# EAGLE design ece_411_team9_bird_feeder (EAGLE 9.6.2)
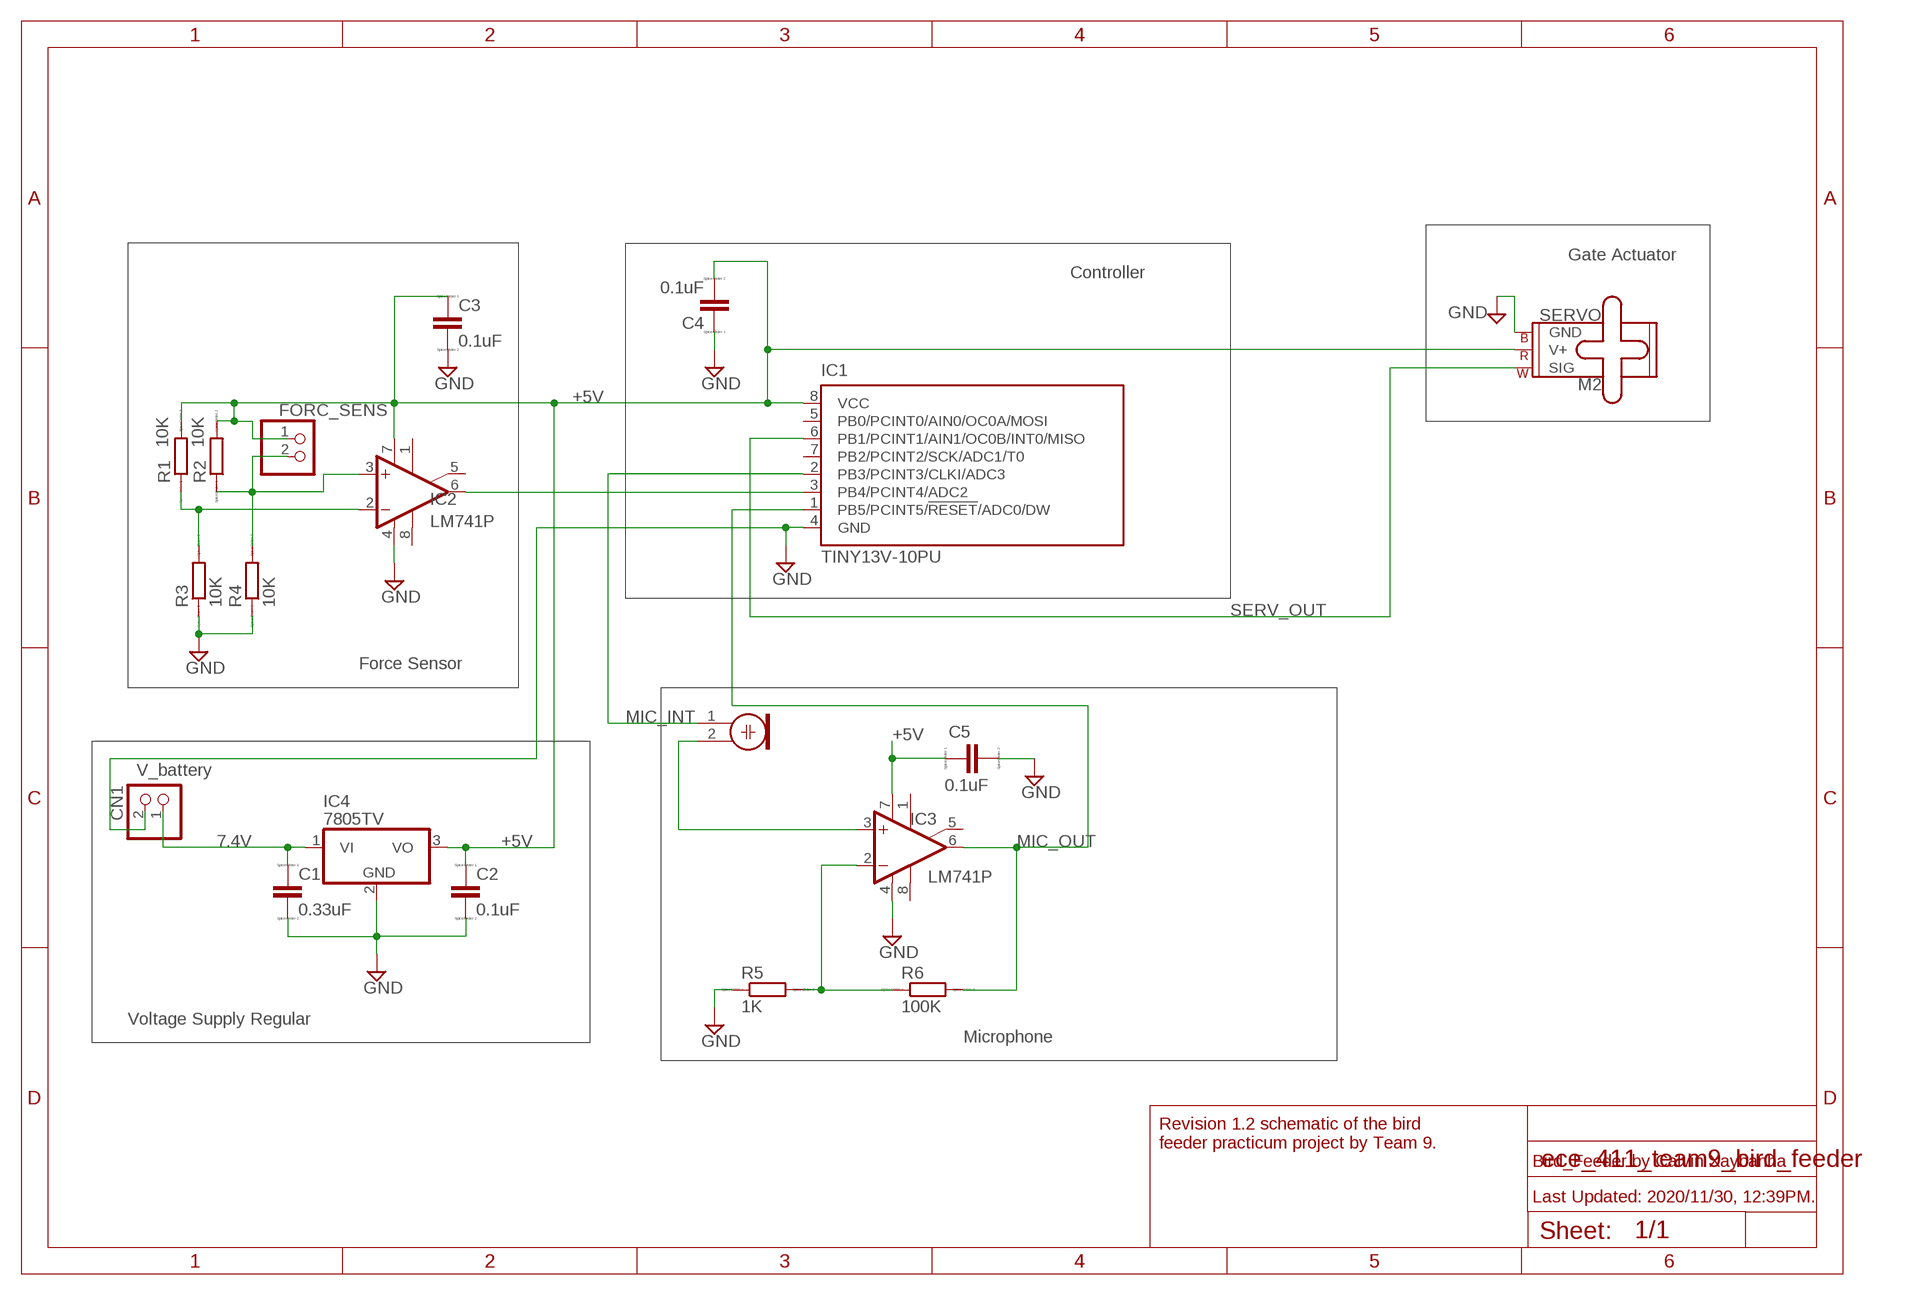
[diagram p0: schematic, sheet 1]

## Parts
C1  0.33uF  C  [C0805]
C2  0.1uF  C  [C0805]
C3  0.1uF  C  [C0805]
C4  0.1uF  C  [C0805]
C5  0.1uF  C  [C0805]
CN1  V_battery  JST_2PIN-SMT  [JST-PH-2-SMT]
FORC_SENS  PINHD-1X2/90  [1X02/90]
IC1  TINY13V-10PU  [DIL08]
IC2  LM741P  [DIL08]
IC3  LM741P  [DIL08]
IC4  7805TV  [TO220V]
M1  ELECTRET_MICROPHON-WM.64PN  [WM-64PN]
M2  SERVO  [1X03]
R1  10K  R  [R0805]
R2  10K  R  [R0805]
R3  10K  R  [R0805]
R4  10K  R  [R0805]
R5  1K  R  [R0805]
R6  100K  R  [R0805]

## Nets
7.4V: C1.1 CN1.1 IC4.1(VI)
+5V [Power]: C2.1 C3.1 C4.2 C5.1 FORC_SENS.1 IC1.8(VCC) IC2.7(V+) IC3.7(V+) IC4.3(VO) M2.2(V+) R1.2 R2.2
FSNS_OP2 [Signals]: IC2.2(-IN) R1.1 R3.2
FSNS_OP3 [Signals]: FORC_SENS.2 IC2.3(+IN) R2.1 R4.2
FSNS_OUT [Signals]: IC1.3(PB4/PCINT4/ADC2) IC2.6(OUT)
GND: C1.2 C2.2 C3.2 C4.1 C5.2 CN1.2 IC1.4(GND) IC2.4(V-) IC3.4(V-) IC4.2(GND) M2.3(GND) R3.1 R4.1 R5.1
MIC_INT [Signals]: IC1.2(PB3/PCINT3/CLKI/ADC3) M1.1
MIC_OP2 [Signals]: IC3.2(-IN) R5.2 R6.1
MIC_OP3 [Signals]: IC3.3(+IN) M1.2
MIC_OUT [Signals]: IC1.1(PB5/PCINT5/!RESET!/ADC0/DW) IC3.6(OUT) R6.2
SERV_OUT [Signals]: IC1.6(PB1/PCINT1/AIN1/OC0B/INT0/MISO) M2.1(SIG)
Unconnected: IC1.5(PB0/PCINT0/AIN0/OC0A/MOSI) IC1.7(PB2/PCINT2/SCK/ADC1/T0) IC2.1(ON1) IC2.5(ON2) IC2.8(OPT) IC3.1(ON1) IC3.5(ON2) IC3.8(OPT)

## Notes on the sheet
- Gate Actuator
- Controller
- Force Sensor
- Voltage Supply Regular
- Microphone
- Revision 1.2 schematic of the bird
  feeder practicum project by Team 9.
- Bird_Feeder by Calvin Xaybanha
- Last Updated: 2020/11/30, 12:39PM.

## Library data of the parts
C1-C5 = eagle-ltspice:C: CAPACITOR, European symbol; SPICEMODEL: NONE; SPICEPREFIX: C
CN1 = adafruit:JST_2PIN: JST 2-Pin Connectors of various flavors SMT-RA (S2B-PH-SM4) 4UConnector #17311 SMT (B2B-PH-SM4) THM-RA (S2B-PH) THM (B2B-PH)
FORC_SENS = pinhead:PINHD-1X2: PIN HEADER
IC1 = atmel:TINY13: 8-bit AVR Microcontroller with 1K Bytes In-System Programmable Flash Source: http://www.atmel.com/dyn/resources/prod_documents/2535S.pdf; MPN: ATTINY13V-10PU; OC_FARNELL: 9171576; OC_NEWARK: 96K6523
IC2 IC3 = linear:*741: OP AMP
IC4 = linear:78*: Positive VOLTAGE REGULATOR Source: http://cache.national.com/ds/LM/LM78L05.pdf http://www.fairchildsemi.com/ds/LM/LM7805.pdf
M1 = microphon:ELECTRET_MICROPHON-: Electret Condenser Microphone
M2 = SparkFun-Electromechanical:SERVO: Servo Motor 3-pin connector for a standard servo motor (voltage supply, ground, and control signal.) SparkFun Products Servo - Generic (Sub-Micro Size) <https://www.sparkfun.com/products/9065> (ROB-09065) Servo - Generic High Torque Continuous Rotation (Standard Size) <https://www.sparkfun.com/products/9347> (ROB-09347) Servo - Generic High Torque (Standard Size) <https://www.sparkfun.com/products/11965> (ROB-11965)
R1-R6 = eagle-ltspice:R: RESISTOR, European symbol; SPICEMODEL: NONE; SPICEPREFIX: R

## Module CONTROLLER
Ports: 

### Library data of the parts

## Net classes
0 default: width 0.305 mm
1 Power: width 1.27 mm
2 Signals: width 0.305 mm

## Board
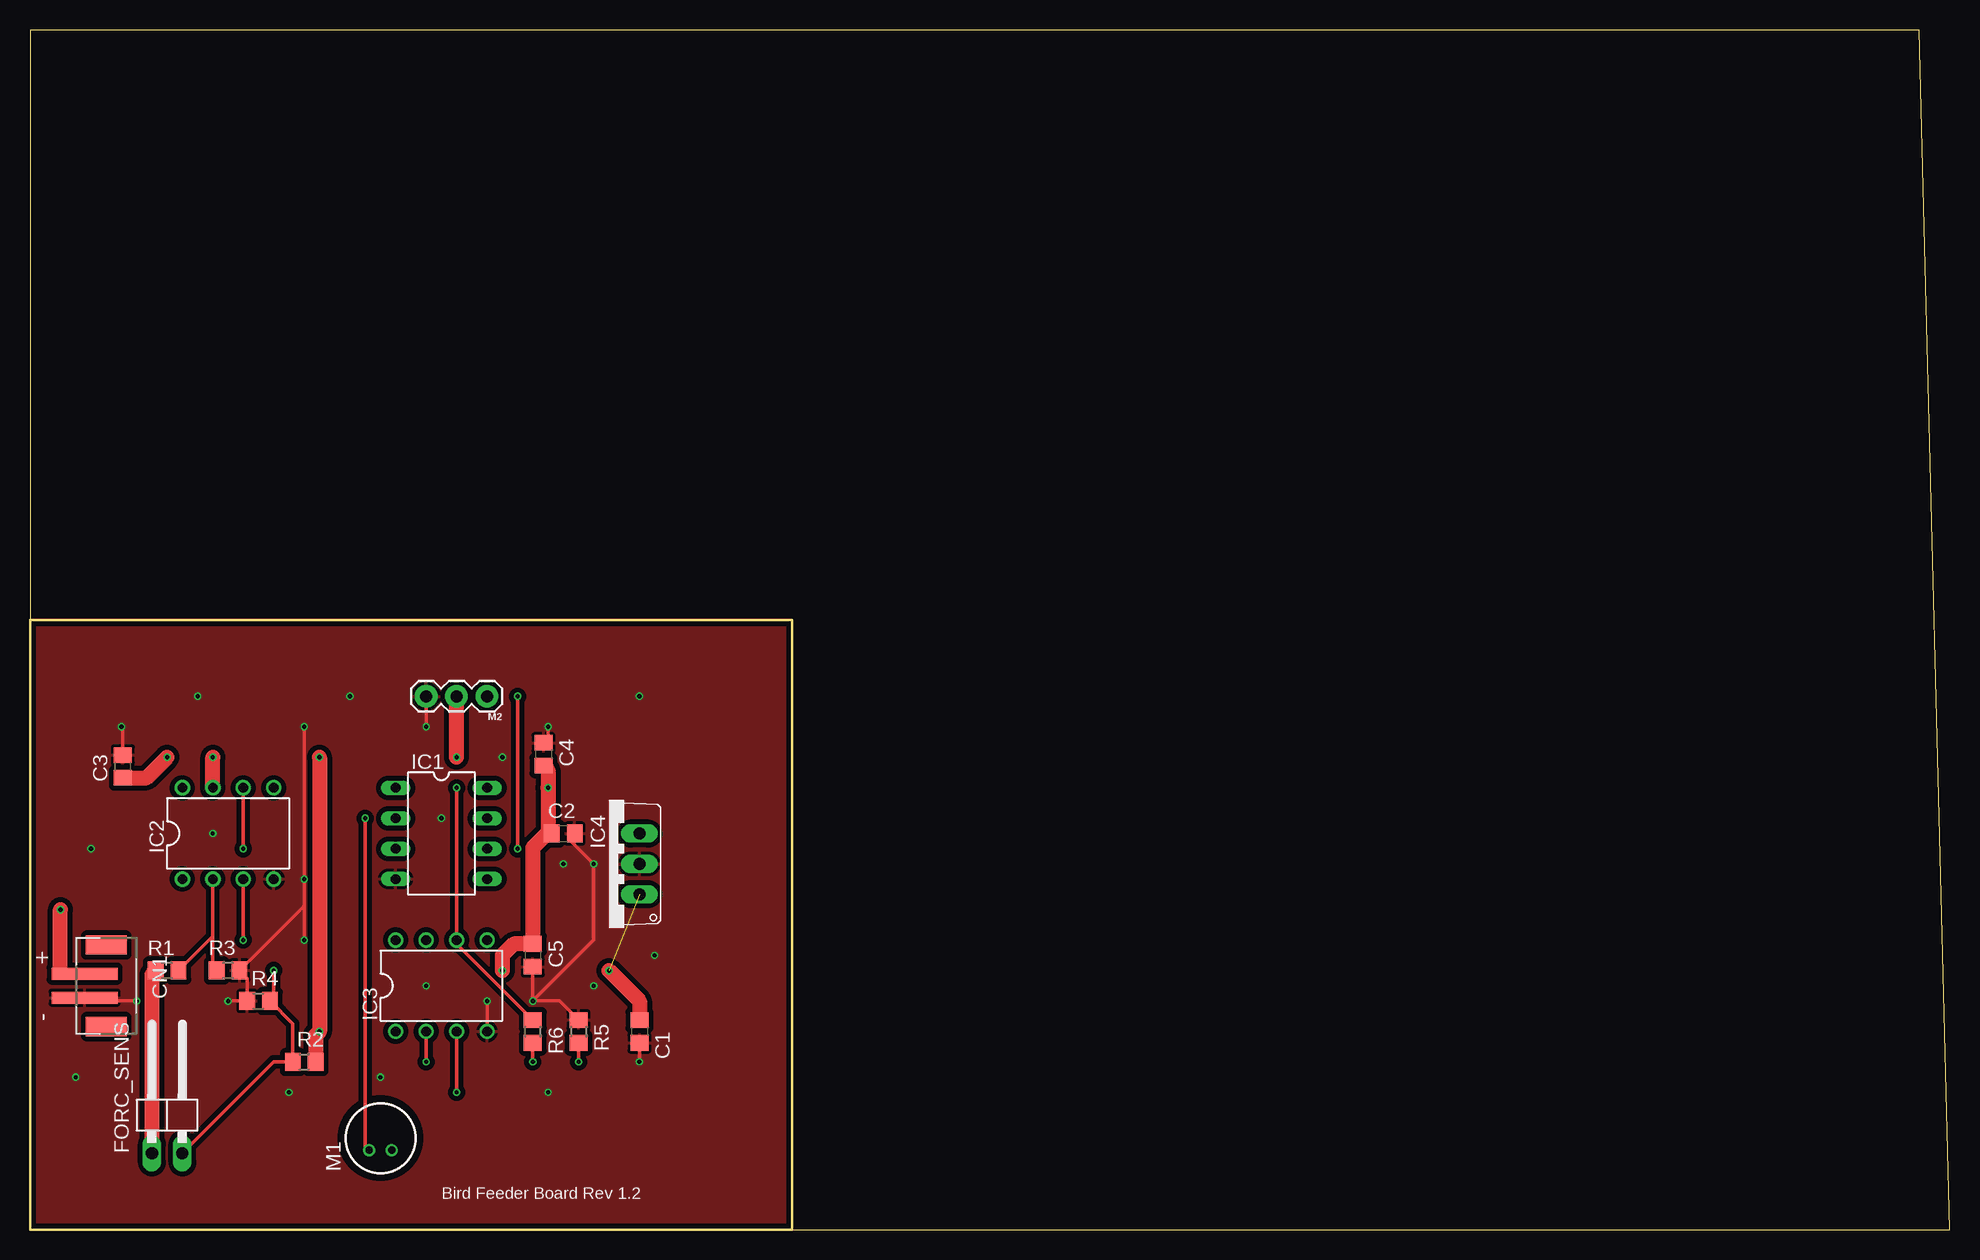
[diagram p1: board, top side]
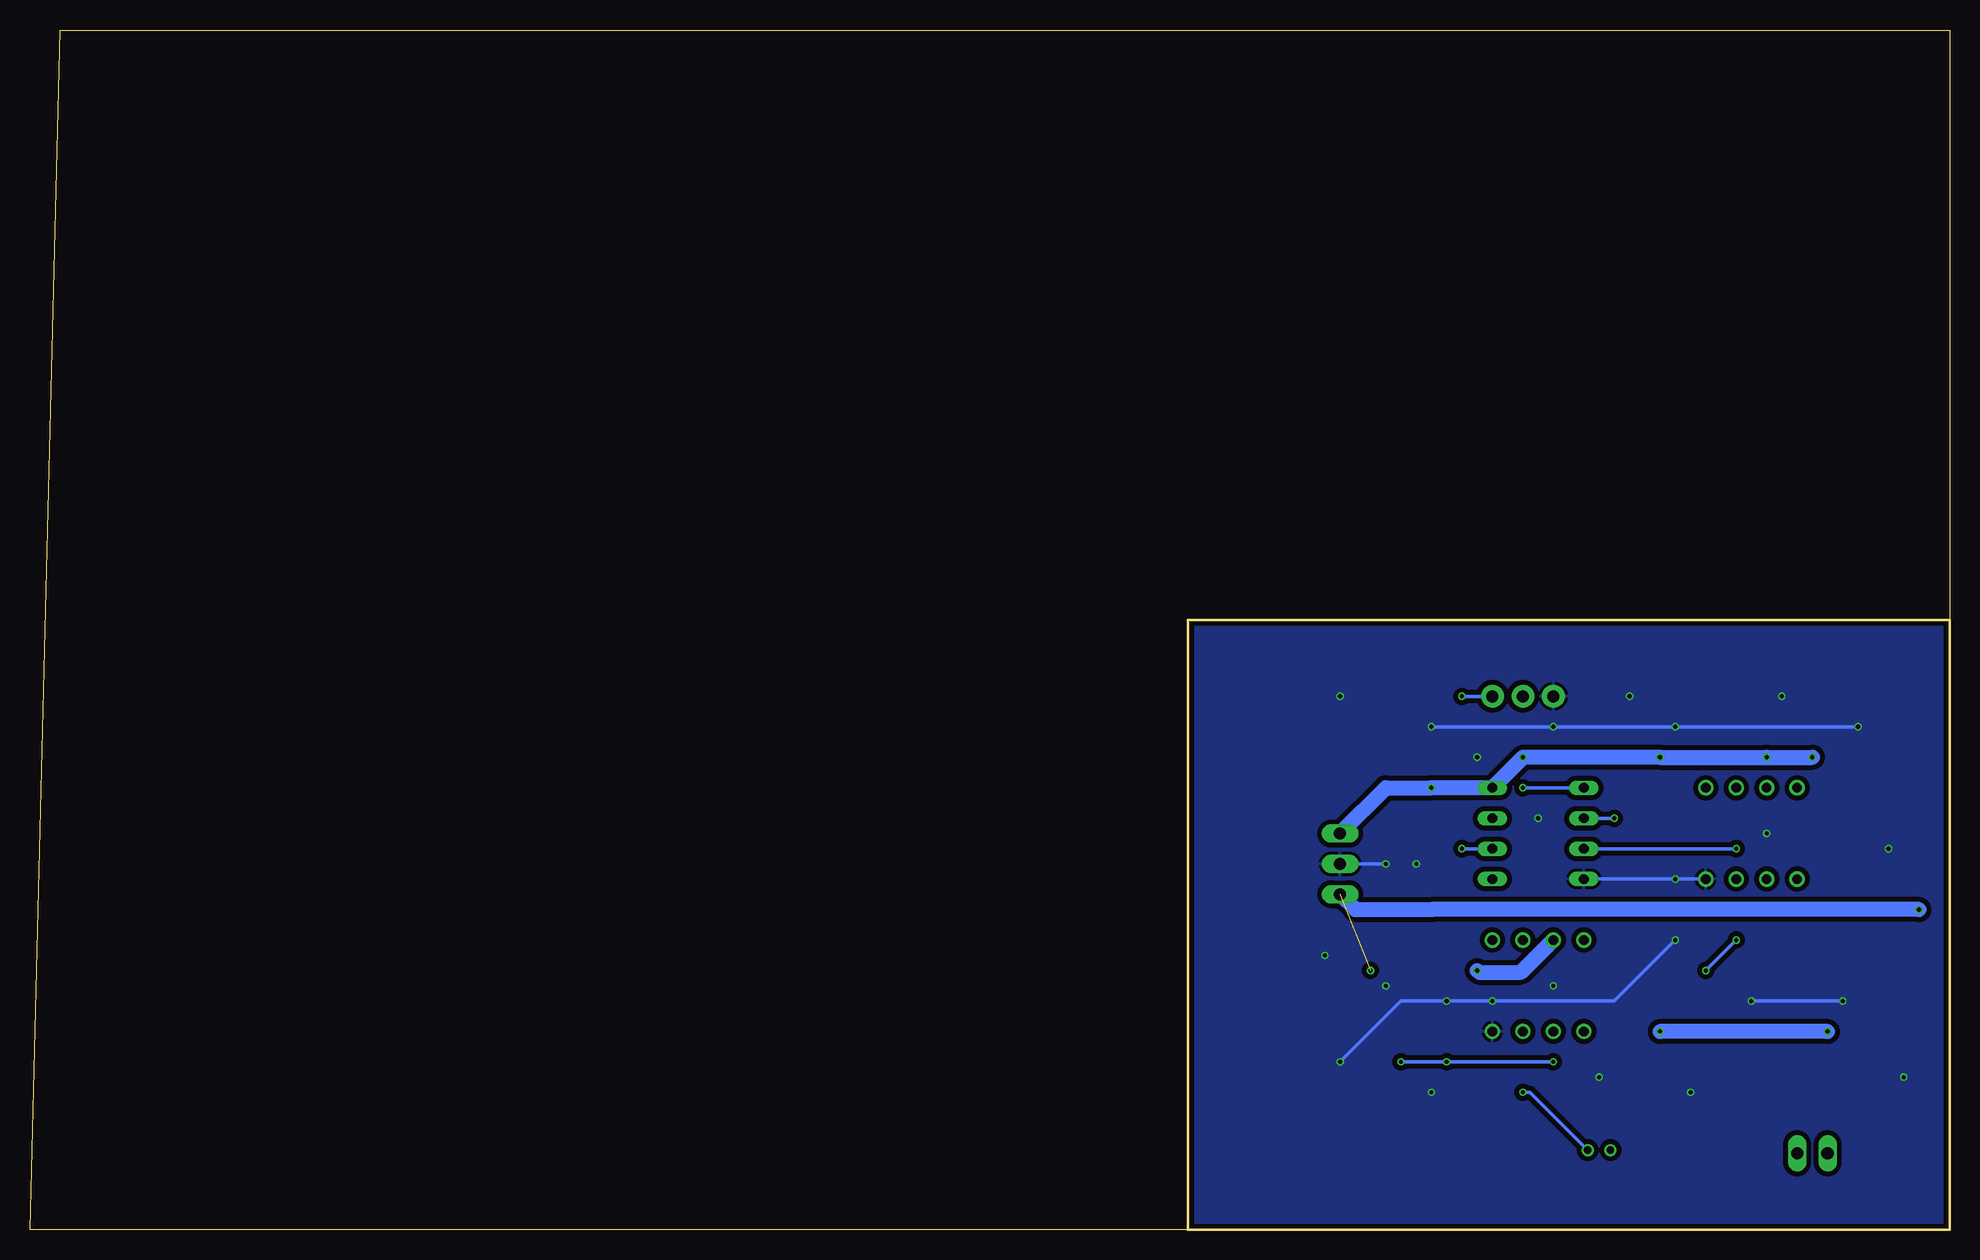
[diagram p2: board, bottom side, seen from below]

Size 160 x 100 mm. Coordinates in mm from the lower left corner, seen from the top.
Outline: 63.5,0 160,0 157.46,100 0,100 0,50.8
Outline: 0,50.8 0,0 63.5,0
Outline: 0,50.8 63.5,50.8 63.5,0
Copper layers (1*16): Top 0.035559375mm / dielectric 1.6mm / Bottom 0.035559375mm
Design rules "oshpark-2layer": minimum track width 6mil, minimum drill 10mil, track to track 6mil, track to pad 6mil, pad to pad 6mil, via to via 6mil, smd to smd 6mil, copper to edge 15mil, drill to drill 6mil, minimum pad ring 5mil, minimum via ring 5mil, stop-mask expansion 2.5mil, vias tented up to drill 0mil, thermal gap 10mil

### Footprints (pad centres in the part's own frame; a part is rotated, then mirrored left to right if it is on the bottom)
C0805 = smd 1.3 x 1.5: 1 -0.95,0; 2 0.95,0
JST-PH-2-SMT = smd 1 x 5.5: 1 -1,-1.8; 2 1,-1.8 | smd 1.6 x 3.4: NC1 -3.4,0; NC2 3.4,0
1X02/90 = drill 1.016 long: 1 -1.27,-3.81; 2 1.27,-3.81
DIL08 = drill 0.813 long: 1 -3.81,-3.81; 2 -1.27,-3.81; 3 1.27,-3.81; 4 3.81,-3.81; 5 3.81,3.81; 6 1.27,3.81; 7 -1.27,3.81; 8 -3.81,3.81
DIL08' = drill 0.813 pad 1.27: 1 -3.81,-3.81; 2 -1.27,-3.81; 3 1.27,-3.81; 4 3.81,-3.81; 5 3.81,3.81; 6 1.27,3.81; 7 -1.27,3.81; 8 -3.81,3.81
TO220V = drill 1.016 long: 1 -2.54,-2.54; 2 0,-2.54; 3 2.54,-2.54
WM-64PN = drill 0.6 pad 1: 1 -1,0.95; 2 -1,-0.95
1X03 = drill 1.016 pad 1.88: 1 0,0; 2 2.54,0; 3 5.08,0
R0805 = smd 1.3 x 1.5: 1 -0.95,0; 2 0.95,0

### Placement (x,y rotation side)
C1  50.8,16.51 270 top
C2  44.45,33.02 0 top
C3  7.75,38.61 90 top
C4  42.8,39.62 270 top
C5  41.91,22.86 270 top
CN1  6.35,20.32 270 top
FORC_SENS  11.43,10.16 0 top
IC1  34.29,33.02 270 top
IC2  LM741P  [DIL08']  16.51,33.02 0 top
IC3  LM741P  [DIL08']  34.29,20.32 0 top
IC4  48.26,30.48 90 top
M1  29.21,7.62 90 top
M2  38.1,44.45 180 top
R1  11.43,21.59 180 top
R2  22.86,13.97 0 top
R3  16.51,21.59 180 top
R4  19.05,19.05 0 top
R5  45.72,16.51 270 top
R6  41.91,16.51 90 top

### Tracks (layer width: path | path; a pad name or v marks a point on that pad's centre or on a via)
7.4V  (via drill 0.35)  (1 unrouted)
  Top 0.305: CN1.1 2.81,21.32 2.54,21.59
  Top 1.27: 2.54,21.59 v2.54,26.67 | v48.26,21.59 50.8,19.05 C1.1
  Bottom 1.27: IC4.1 49.53,26.67 43.18,26.67 v2.54,26.67
+5V  (via drill 0.35)
  Top 1.27: v35.56,39.37 M2.2 | C4.2 43.18,38.29 v43.18,36.83 43.18,33.1 | v24.13,39.37 v24.13,16.51 23.81,16.19 R2.2 | R1.2 10.16,21.27 v10.16,16.51 FORC_SENS.1 | C2.1 43.18,33.1 | 43.18,33.1 41.91,31.83 C5.1 40.32,23.81 39.37,22.86 v39.37,21.59 | IC2.7 v15.24,39.37 | C3.1 9.72,37.66 v11.43,39.37
  Bottom 1.27: IC4.3 46.99,36.83 v43.18,36.83 IC1.8 v35.56,39.37 v24.13,39.37 v15.24,39.37 v11.43,39.37 | v39.37,21.59 39.22,21.44 35.71,21.44 IC3.7 | v10.16,16.51 v24.13,16.51
FSNS_OP2
  Top 0.305: IC2.2 15.24,25.4 15.24,24.45 | 15.24,24.45 15.24,21.91 R3.2 | R1.1 15.24,24.45
FSNS_OP3  (via drill 0.35)
  Top 0.305: IC2.3 v17.78,24.13 | v20.32,21.59 20.32,19.37 R4.2 21.91,17.14 R2.1 20.32,13.97 FORC_SENS.2
  Bottom 0.305: v17.78,24.13 v20.32,21.59
FSNS_OUT  (via drill 0.35)
  Top 0.305: v17.78,31.75 IC2.6
  Bottom 0.305: IC1.3 v17.78,31.75
GND  (via drill 0.35)
  Top 0.305: IC3.4 v38.1,19.05 | 22.86,26.99 v22.86,29.21 v22.86,41.91 | 22.86,26.99 v22.86,24.13 | M2.3 v33.02,41.91 | v43.18,41.91 43.18,40.95 C4.1 | v7.62,41.91 7.75,41.78 C3.2 | C5.2 v41.91,19.05 | v41.91,19.05 46.99,24.13 v46.99,30.48 44.99,32.48 C2.2 | C1.2 v50.8,13.97 | 22.86,26.99 R3.1 18.1,20.95 R4.1 v16.51,19.05 | v8.89,19.05 6.35,19.05 6.08,19.32 CN1.2 | v41.91,19.05 44.13,19.05 R5.1
  Bottom 0.305: IC2.4 v22.86,29.21 IC1.4 | v43.18,41.91 v33.02,41.91 v22.86,41.91 v7.62,41.91 | v46.99,30.48 IC4.2 | v50.8,13.97 45.72,19.05 v41.91,19.05 v38.1,19.05 27.94,19.05 v22.86,24.13 | v8.89,19.05 v16.51,19.05
  other vias: 3.81,12.7 21.59,11.43 29.21,12.7 43.18,11.43 52.07,22.86 46.99,20.32 33.02,20.32 5.08,31.75 15.24,33.02 44.45,30.48 34.29,34.29 50.8,44.45 39.37,39.37 26.67,44.45 13.97,44.45
  pour Bottom (isolate 0.406, rank 2): 0,50.8 63.5,50.8 63.5,0 0,0 0,49.53
  pour Bottom (isolate 0.406): 0,50.8 63.5,50.8 63.5,0 0,0
  pour Top (isolate 0.406): 0,0 0,50.8 63.5,50.8 63.5,0
MIC_INT  (via drill 0.35)
  Top 0.305: v27.94,34.29 27.94,6.94 M1.1
  Bottom 0.305: IC1.2 v27.94,34.29
MIC_OP2  (via drill 0.35)
  Top 0.305: IC3.2 v33.02,13.97 | v41.91,13.97 R6.1 | v45.72,13.97 R5.2
  Bottom 0.305: v33.02,13.97 v41.91,13.97 v45.72,13.97
MIC_OP3  (via drill 0.35)
  Top 0.305: v35.56,11.43 IC3.3
  Bottom 0.305: M1.2 34.97,11.43 v35.56,11.43
MIC_OUT  (via drill 0.35)
  Top 0.305: R6.2 35.56,23.81 IC3.6 v35.56,36.83
  Bottom 0.305: v35.56,36.83 IC1.1
SERV_OUT  (via drill 0.35)
  Top 0.305: v40.64,44.45 v40.64,31.75
  Bottom 0.305: IC1.6 v40.64,31.75 | v40.64,44.45 M2.1

### Text on the board
tNames: Bird Feeder Board Rev 1.2
tValues: V_BATT | GND